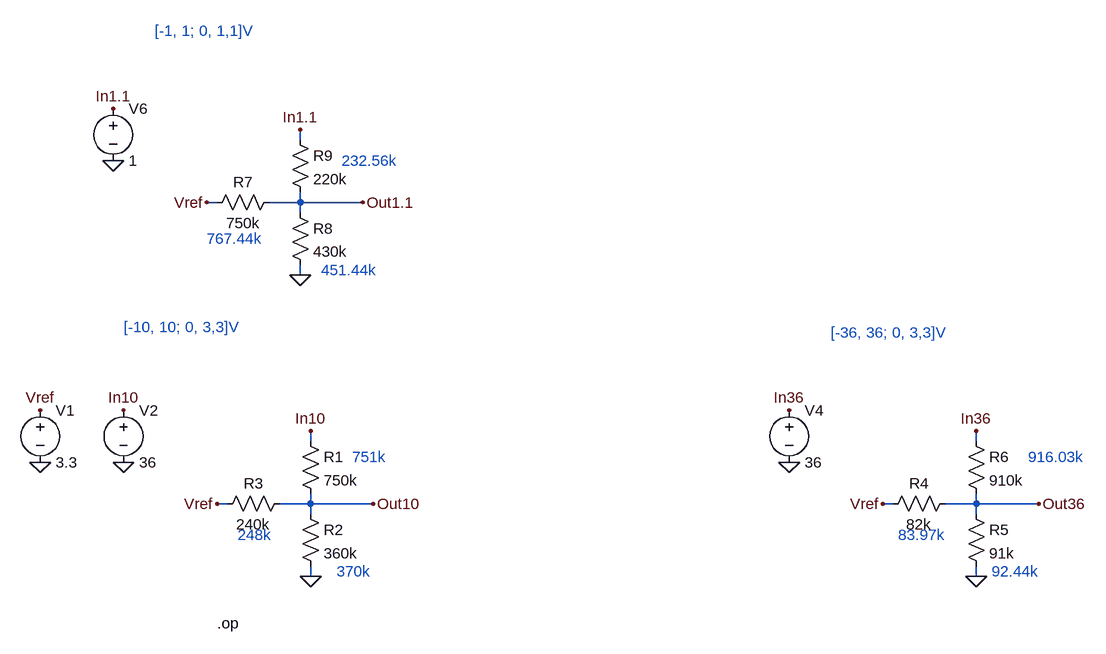
[diagram p0: schematic Draft1.asc]
Draft1.asc, the LTspice schematic file:
Version 4.1
SHEET 1 2088 680
WIRE -16 -336 -16 -352
WIRE -144 -240 -160 -240
WIRE -16 -240 -16 -256
WIRE -16 -240 -64 -240
WIRE 80 -240 -16 -240
WIRE -16 -224 -16 -240
WIRE -16 -128 -16 -144
WIRE 0 128 0 112
WIRE 1024 128 1024 112
WIRE -128 224 -144 224
WIRE 0 224 0 208
WIRE 0 224 -48 224
WIRE 96 224 0 224
WIRE 896 224 880 224
WIRE 1024 224 1024 208
WIRE 1024 224 976 224
WIRE 1120 224 1024 224
WIRE 0 240 0 224
WIRE 1024 240 1024 224
WIRE 0 336 0 320
WIRE 1024 336 1024 320
FLAG -288 80 In10
FLAG 96 224 Out10
FLAG -288 160 0
FLAG -416 160 0
FLAG 0 336 0
FLAG 0 112 In10
FLAG 736 80 In36
FLAG 1120 224 Out36
FLAG 736 160 0
FLAG 880 224 Vref
FLAG 1024 336 0
FLAG 1024 112 In36
FLAG -304 -384 In1.1
FLAG 80 -240 Out1.1
FLAG -304 -304 0
FLAG -160 -240 Vref
FLAG -16 -128 0
FLAG -16 -352 In1.1
FLAG -144 224 Vref
FLAG -416 80 Vref
SYMBOL voltage -416 64 R0
WINDOW 123 0 0 Left 0
WINDOW 39 0 0 Left 0
SYMATTR InstName V1
SYMATTR Value 3.3
SYMBOL voltage -288 64 R0
WINDOW 123 0 0 Left 0
WINDOW 39 0 0 Left 0
SYMATTR InstName V2
SYMATTR Value 36
SYMBOL res -32 208 R90
WINDOW 0 0 56 VBottom 2
WINDOW 3 32 56 VTop 2
SYMATTR InstName R3
SYMATTR Value 240k
SYMBOL res -16 224 R0
SYMATTR InstName R2
SYMATTR Value 360k
SYMBOL res -16 112 R0
SYMATTR InstName R1
SYMATTR Value 750k
SYMBOL voltage 736 64 R0
WINDOW 123 0 0 Left 0
WINDOW 39 0 0 Left 0
SYMATTR InstName V4
SYMATTR Value 36
SYMBOL res 992 208 R90
WINDOW 0 0 56 VBottom 2
WINDOW 3 32 56 VTop 2
SYMATTR InstName R4
SYMATTR Value 82k
SYMBOL res 1008 224 R0
SYMATTR InstName R5
SYMATTR Value 91k
SYMBOL res 1008 112 R0
SYMATTR InstName R6
SYMATTR Value 910k
SYMBOL voltage -304 -400 R0
WINDOW 123 0 0 Left 0
WINDOW 39 0 0 Left 0
SYMATTR InstName V6
SYMATTR Value 1
SYMBOL res -48 -256 R90
WINDOW 0 0 56 VBottom 2
WINDOW 3 32 56 VTop 2
SYMATTR InstName R7
SYMATTR Value 750k
SYMBOL res -32 -240 R0
SYMATTR InstName R8
SYMATTR Value 430k
SYMBOL res -32 -352 R0
SYMATTR InstName R9
SYMATTR Value 220k
TEXT -144 408 Left 2 !.op
TEXT -288 -48 Left 2 ;[-10, 10; 0, 3,3]V
TEXT 800 -40 Left 2 ;[-36, 36; 0, 3,3]V
TEXT -240 -504 Left 2 ;[-1, 1; 0, 1,1]V
TEXT 40 328 Left 2 ;370k
TEXT 64 152 Left 2 ;751k
TEXT -112 272 Left 2 ;248k
TEXT 1048 328 Left 2 ;92.44k
TEXT 1104 152 Left 2 ;916.03k
TEXT 904 272 Left 2 ;83.97k
TEXT -160 -184 Left 2 ;767.44k
TEXT 48 -304 Left 2 ;232.56k
TEXT 16 -136 Left 2 ;451.44k

The netlist it stands for:
* Draft1.asc
V1 Vref 0 3.3
V2 In10 0 36
R3 Out10 Vref 240k
R2 Out10 0 360k
R1 In10 Out10 750k
V4 In36 0 36
R4 Out36 Vref 82k
R5 Out36 0 91k
R6 In36 Out36 910k
V6 In1.1 0 1
R7 Out1.1 Vref 750k
R8 Out1.1 0 430k
R9 In1.1 Out1.1 220k
.op
* [-10, 10; 0, 3,3]V
* [-36, 36; 0, 3,3]V
* [-1, 1; 0, 1,1]V
* 370k
* 751k
* 248k
* 92.44k
* 916.03k
* 83.97k
* 767.44k
* 232.56k
* 451.44k
.backanno
.end